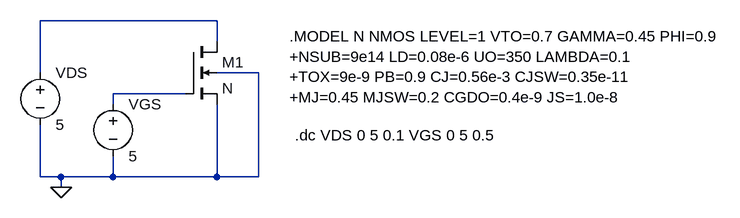
[diagram p0: schematic MOSFET-Output.asc]
MOSFET-Output.asc, the LTspice schematic file:
Version 4
SHEET 1 984 680
WIRE 144 128 -128 128
WIRE 144 160 144 128
WIRE -128 208 -128 128
WIRE 208 208 144 208
WIRE 96 240 -16 240
WIRE -16 256 -16 240
WIRE -128 368 -128 288
WIRE -96 368 -128 368
WIRE -16 368 -16 336
WIRE -16 368 -96 368
WIRE 144 368 144 256
WIRE 144 368 -16 368
WIRE 208 368 208 208
WIRE 208 368 144 368
WIRE -96 384 -96 368
FLAG -96 384 0
SYMBOL nmos4 96 160 R0
SYMATTR InstName M1
SYMATTR Value N
SYMATTR Value2 l=4u w=1u
SYMBOL voltage -128 192 R0
WINDOW 123 0 0 Left 0
WINDOW 39 0 0 Left 0
SYMATTR InstName VDS
SYMATTR Value 5
SYMBOL voltage -16 240 R0
WINDOW 123 0 0 Left 0
WINDOW 39 0 0 Left 0
SYMATTR InstName VGS
SYMATTR Value 5
TEXT 256 152 Left 2 !.MODEL N NMOS LEVEL=1 VTO=0.7 GAMMA=0.45 PHI=0.9\n+NSUB=9e14 LD=0.08e-6 UO=350 LAMBDA=0.1\n+TOX=9e-9 PB=0.9 CJ=0.56e-3 CJSW=0.35e-11\n+MJ=0.45 MJSW=0.2 CGDO=0.4e-9 JS=1.0e-8
TEXT 264 304 Left 2 !.dc VDS 0 5 0.1 VGS 0 5 0.5

The netlist it stands for:
* MOSFET-Output.asc
M1 N001 N002 0 0 N l=4u w=1u
VDS N001 0 5
VGS N002 0 5
.model NMOS NMOS
.model PMOS PMOS
.lib standard.mos
.MODEL N NMOS LEVEL=1 VTO=0.7 GAMMA=0.45 PHI=0.9
+NSUB=9e14 LD=0.08e-6 UO=350 LAMBDA=0.1
+TOX=9e-9 PB=0.9 CJ=0.56e-3 CJSW=0.35e-11
+MJ=0.45 MJSW=0.2 CGDO=0.4e-9 JS=1.0e-8
.dc VDS 0 5 0.1 VGS 0 5 0.5
.backanno
.end